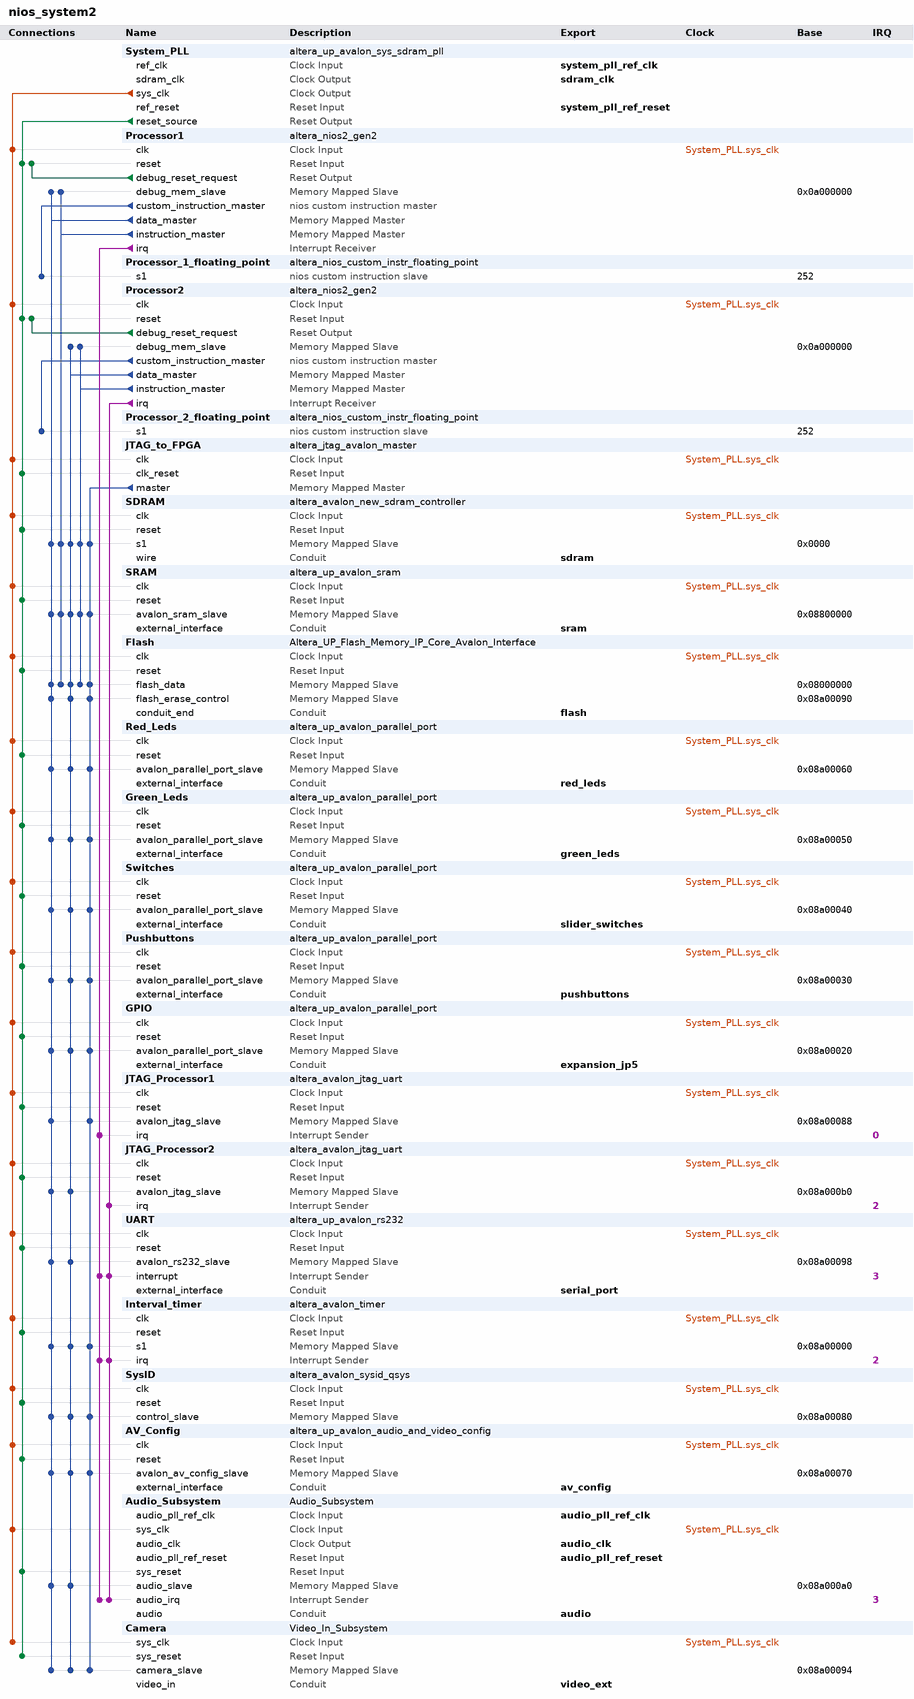
[diagram p0: system contents]
# Platform Designer (Qsys) system nios_system2, Cyclone IV E EP4CE115F29C7
# Parameters at their usual value, and those the tool derives, are not listed.
package require -exact qsys 16.1
create_system nios_system2
set_project_property DEVICE_FAMILY {Cyclone IV E}
set_project_property DEVICE EP4CE115F29C7

add_instance System_PLL altera_up_avalon_sys_sdram_pll 16.1
set_instance_parameter_value System_PLL CV_boards DE1-SoC
set_instance_parameter_value System_PLL gui_outclk 50.0
set_instance_parameter_value System_PLL gui_refclk 50.0

add_instance Processor1 altera_nios2_gen2 16.1
set_instance_parameter_value Processor1 dcache_size 2048
set_instance_parameter_value Processor1 dividerType srt2
set_instance_parameter_value Processor1 exceptionSlave SDRAM.s1
set_instance_parameter_value Processor1 icache_size 4096
set_instance_parameter_value Processor1 impl Tiny
set_instance_parameter_value Processor1 mul_64_impl 1
set_instance_parameter_value Processor1 mul_shift_choice 1
set_instance_parameter_value Processor1 resetSlave SDRAM.s1

add_instance Processor_1_floating_point altera_nios_custom_instr_floating_point 16.1

add_instance Processor2 altera_nios2_gen2 16.1
set_instance_parameter_value Processor2 dcache_size 2048
set_instance_parameter_value Processor2 dividerType srt2
set_instance_parameter_value Processor2 exceptionOffset 67108896
set_instance_parameter_value Processor2 exceptionSlave SDRAM.s1
set_instance_parameter_value Processor2 icache_size 4096
set_instance_parameter_value Processor2 impl Tiny
set_instance_parameter_value Processor2 mul_64_impl 1
set_instance_parameter_value Processor2 mul_shift_choice 1
set_instance_parameter_value Processor2 resetOffset 67108864
set_instance_parameter_value Processor2 resetSlave SDRAM.s1

add_instance Processor_2_floating_point altera_nios_custom_instr_floating_point 16.1

add_instance JTAG_to_FPGA altera_jtag_avalon_master 16.1

add_instance SDRAM altera_avalon_new_sdram_controller 16.1
set_instance_parameter_value SDRAM TAC 5.5
set_instance_parameter_value SDRAM TRCD 20.0
set_instance_parameter_value SDRAM TRP 20.0
set_instance_parameter_value SDRAM casLatency 3
set_instance_parameter_value SDRAM columnWidth 10
set_instance_parameter_value SDRAM dataWidth 32
set_instance_parameter_value SDRAM generateSimulationModel false
set_instance_parameter_value SDRAM model single_Micron_MT48LC4M32B2_7_chip
set_instance_parameter_value SDRAM numberOfBanks 4
set_instance_parameter_value SDRAM numberOfChipSelects 1
set_instance_parameter_value SDRAM powerUpDelay 100.0
set_instance_parameter_value SDRAM refreshPeriod 15.625
set_instance_parameter_value SDRAM rowWidth 13

add_instance SRAM altera_up_avalon_sram 16.1
set_instance_parameter_value SRAM board DE2-115
set_instance_parameter_value SRAM pixel_buffer false

add_instance Flash Altera_UP_Flash_Memory_IP_Core_Avalon_Interface 16.1
set_instance_parameter_value Flash FLASH_MEMORY_ADDRESS_WIDTH 23

add_instance Red_Leds altera_up_avalon_parallel_port 16.1
set_instance_parameter_value Red_Leds board DE2-115
set_instance_parameter_value Red_Leds capture false
set_instance_parameter_value Red_Leds edge Rising
set_instance_parameter_value Red_Leds irq false
set_instance_parameter_value Red_Leds leds Red
set_instance_parameter_value Red_Leds preset LEDs

add_instance Green_Leds altera_up_avalon_parallel_port 16.1
set_instance_parameter_value Green_Leds board DE2-115
set_instance_parameter_value Green_Leds capture false
set_instance_parameter_value Green_Leds edge Rising
set_instance_parameter_value Green_Leds irq false
set_instance_parameter_value Green_Leds preset LEDs

add_instance Switches altera_up_avalon_parallel_port 16.1
set_instance_parameter_value Switches board DE2-115
set_instance_parameter_value Switches capture false
set_instance_parameter_value Switches edge Rising
set_instance_parameter_value Switches irq false
set_instance_parameter_value Switches preset {Slider Switches}

add_instance Pushbuttons altera_up_avalon_parallel_port 16.1
set_instance_parameter_value Pushbuttons board DE2-115
set_instance_parameter_value Pushbuttons capture false
set_instance_parameter_value Pushbuttons edge Rising
set_instance_parameter_value Pushbuttons irq false
set_instance_parameter_value Pushbuttons preset Pushbuttons

add_instance GPIO altera_up_avalon_parallel_port 16.1
set_instance_parameter_value GPIO board DE2-115
set_instance_parameter_value GPIO capture false
set_instance_parameter_value GPIO edge Rising
set_instance_parameter_value GPIO irq false
set_instance_parameter_value GPIO preset {Expansion Header}

add_instance JTAG_Processor1 altera_avalon_jtag_uart 16.1
set_instance_parameter_value JTAG_Processor1 simInteractiveOptions NO_INTERACTIVE_WINDOWS

add_instance JTAG_Processor2 altera_avalon_jtag_uart 16.1
set_instance_parameter_value JTAG_Processor2 simInteractiveOptions NO_INTERACTIVE_WINDOWS

add_instance UART altera_up_avalon_rs232 16.1
set_instance_parameter_value UART baud 115200
set_instance_parameter_value UART parity None

add_instance Interval_timer altera_avalon_timer 16.1
set_instance_parameter_value Interval_timer period 125.0
set_instance_parameter_value Interval_timer periodUnits MSEC

add_instance SysID altera_avalon_sysid_qsys 16.1
set_instance_parameter_value SysID id -1988733927

add_instance AV_Config altera_up_avalon_audio_and_video_config 16.1
set_instance_parameter_value AV_Config audio_in {Microphone to ADC}
set_instance_parameter_value AV_Config bit_length 24
set_instance_parameter_value AV_Config board DE1-SoC
set_instance_parameter_value AV_Config line_in_bypass false
set_instance_parameter_value AV_Config sampling_rate {48 kHz}

add_instance Audio_Subsystem Audio_Subsystem 1.0

add_instance Camera Video_In_Subsystem 1.0

# connections
add_connection System_PLL.sys_clk Audio_Subsystem.sys_clk clock
add_connection System_PLL.sys_clk AV_Config.clk clock
add_connection System_PLL.sys_clk Camera.sys_clk clock
add_connection System_PLL.sys_clk Flash.clk clock
add_connection System_PLL.sys_clk GPIO.clk clock
add_connection System_PLL.sys_clk Green_Leds.clk clock
add_connection System_PLL.sys_clk Interval_timer.clk clock
add_connection System_PLL.sys_clk JTAG_Processor1.clk clock
add_connection System_PLL.sys_clk JTAG_Processor2.clk clock
add_connection System_PLL.sys_clk JTAG_to_FPGA.clk clock
add_connection System_PLL.sys_clk Processor1.clk clock
add_connection System_PLL.sys_clk Processor2.clk clock
add_connection System_PLL.sys_clk Pushbuttons.clk clock
add_connection System_PLL.sys_clk Red_Leds.clk clock
add_connection System_PLL.sys_clk SDRAM.clk clock
add_connection System_PLL.sys_clk SRAM.clk clock
add_connection System_PLL.sys_clk Switches.clk clock
add_connection System_PLL.sys_clk SysID.clk clock
add_connection System_PLL.sys_clk UART.clk clock
add_connection Processor1.debug_reset_request Processor1.reset reset
add_connection Processor2.debug_reset_request Processor2.reset reset
add_connection System_PLL.reset_source Audio_Subsystem.sys_reset reset
add_connection System_PLL.reset_source AV_Config.reset reset
add_connection System_PLL.reset_source Camera.sys_reset reset
add_connection System_PLL.reset_source Flash.reset reset
add_connection System_PLL.reset_source GPIO.reset reset
add_connection System_PLL.reset_source Green_Leds.reset reset
add_connection System_PLL.reset_source Interval_timer.reset reset
add_connection System_PLL.reset_source JTAG_Processor1.reset reset
add_connection System_PLL.reset_source JTAG_Processor2.reset reset
add_connection System_PLL.reset_source JTAG_to_FPGA.clk_reset reset
add_connection System_PLL.reset_source Processor1.reset reset
add_connection System_PLL.reset_source Processor2.reset reset
add_connection System_PLL.reset_source Pushbuttons.reset reset
add_connection System_PLL.reset_source Red_Leds.reset reset
add_connection System_PLL.reset_source SDRAM.reset reset
add_connection System_PLL.reset_source SRAM.reset reset
add_connection System_PLL.reset_source Switches.reset reset
add_connection System_PLL.reset_source SysID.reset reset
add_connection System_PLL.reset_source UART.reset reset
add_connection JTAG_to_FPGA.master AV_Config.avalon_av_config_slave avalon
set_connection_parameter_value JTAG_to_FPGA.master/AV_Config.avalon_av_config_slave baseAddress 0x08a00070
add_connection JTAG_to_FPGA.master Camera.camera_slave avalon
set_connection_parameter_value JTAG_to_FPGA.master/Camera.camera_slave baseAddress 0x08a00094
add_connection JTAG_to_FPGA.master Flash.flash_data avalon
set_connection_parameter_value JTAG_to_FPGA.master/Flash.flash_data baseAddress 0x08000000
add_connection JTAG_to_FPGA.master Flash.flash_erase_control avalon
set_connection_parameter_value JTAG_to_FPGA.master/Flash.flash_erase_control baseAddress 0x08a00090
add_connection JTAG_to_FPGA.master GPIO.avalon_parallel_port_slave avalon
set_connection_parameter_value JTAG_to_FPGA.master/GPIO.avalon_parallel_port_slave baseAddress 0x08a00020
add_connection JTAG_to_FPGA.master Green_Leds.avalon_parallel_port_slave avalon
set_connection_parameter_value JTAG_to_FPGA.master/Green_Leds.avalon_parallel_port_slave baseAddress 0x08a00050
add_connection JTAG_to_FPGA.master Interval_timer.s1 avalon
set_connection_parameter_value JTAG_to_FPGA.master/Interval_timer.s1 baseAddress 0x08a00000
add_connection JTAG_to_FPGA.master JTAG_Processor1.avalon_jtag_slave avalon
set_connection_parameter_value JTAG_to_FPGA.master/JTAG_Processor1.avalon_jtag_slave baseAddress 0x08a00088
add_connection JTAG_to_FPGA.master Pushbuttons.avalon_parallel_port_slave avalon
set_connection_parameter_value JTAG_to_FPGA.master/Pushbuttons.avalon_parallel_port_slave baseAddress 0x08a00030
add_connection JTAG_to_FPGA.master Red_Leds.avalon_parallel_port_slave avalon
set_connection_parameter_value JTAG_to_FPGA.master/Red_Leds.avalon_parallel_port_slave baseAddress 0x08a00060
add_connection JTAG_to_FPGA.master SDRAM.s1 avalon
set_connection_parameter_value JTAG_to_FPGA.master/SDRAM.s1 baseAddress 0x0000
add_connection JTAG_to_FPGA.master SRAM.avalon_sram_slave avalon
set_connection_parameter_value JTAG_to_FPGA.master/SRAM.avalon_sram_slave baseAddress 0x08800000
add_connection JTAG_to_FPGA.master Switches.avalon_parallel_port_slave avalon
set_connection_parameter_value JTAG_to_FPGA.master/Switches.avalon_parallel_port_slave baseAddress 0x08a00040
add_connection JTAG_to_FPGA.master SysID.control_slave avalon
set_connection_parameter_value JTAG_to_FPGA.master/SysID.control_slave baseAddress 0x08a00080
add_connection Processor1.data_master Audio_Subsystem.audio_slave avalon
set_connection_parameter_value Processor1.data_master/Audio_Subsystem.audio_slave baseAddress 0x08a000a0
add_connection Processor1.data_master AV_Config.avalon_av_config_slave avalon
set_connection_parameter_value Processor1.data_master/AV_Config.avalon_av_config_slave baseAddress 0x08a00070
add_connection Processor1.data_master Camera.camera_slave avalon
set_connection_parameter_value Processor1.data_master/Camera.camera_slave baseAddress 0x08a00094
add_connection Processor1.data_master Flash.flash_data avalon
set_connection_parameter_value Processor1.data_master/Flash.flash_data baseAddress 0x08000000
add_connection Processor1.data_master Flash.flash_erase_control avalon
set_connection_parameter_value Processor1.data_master/Flash.flash_erase_control baseAddress 0x08a00090
add_connection Processor1.data_master GPIO.avalon_parallel_port_slave avalon
set_connection_parameter_value Processor1.data_master/GPIO.avalon_parallel_port_slave baseAddress 0x08a00020
add_connection Processor1.data_master Green_Leds.avalon_parallel_port_slave avalon
set_connection_parameter_value Processor1.data_master/Green_Leds.avalon_parallel_port_slave baseAddress 0x08a00050
add_connection Processor1.data_master Interval_timer.s1 avalon
set_connection_parameter_value Processor1.data_master/Interval_timer.s1 baseAddress 0x08a00000
add_connection Processor1.data_master JTAG_Processor1.avalon_jtag_slave avalon
set_connection_parameter_value Processor1.data_master/JTAG_Processor1.avalon_jtag_slave baseAddress 0x08a00088
add_connection Processor1.data_master JTAG_Processor2.avalon_jtag_slave avalon
set_connection_parameter_value Processor1.data_master/JTAG_Processor2.avalon_jtag_slave baseAddress 0x08a000b0
add_connection Processor1.data_master Processor1.debug_mem_slave avalon
set_connection_parameter_value Processor1.data_master/Processor1.debug_mem_slave baseAddress 0x0a000000
add_connection Processor1.data_master Pushbuttons.avalon_parallel_port_slave avalon
set_connection_parameter_value Processor1.data_master/Pushbuttons.avalon_parallel_port_slave baseAddress 0x08a00030
add_connection Processor1.data_master Red_Leds.avalon_parallel_port_slave avalon
set_connection_parameter_value Processor1.data_master/Red_Leds.avalon_parallel_port_slave baseAddress 0x08a00060
add_connection Processor1.data_master SDRAM.s1 avalon
set_connection_parameter_value Processor1.data_master/SDRAM.s1 baseAddress 0x0000
add_connection Processor1.data_master SRAM.avalon_sram_slave avalon
set_connection_parameter_value Processor1.data_master/SRAM.avalon_sram_slave baseAddress 0x08800000
add_connection Processor1.data_master Switches.avalon_parallel_port_slave avalon
set_connection_parameter_value Processor1.data_master/Switches.avalon_parallel_port_slave baseAddress 0x08a00040
add_connection Processor1.data_master SysID.control_slave avalon
set_connection_parameter_value Processor1.data_master/SysID.control_slave baseAddress 0x08a00080
add_connection Processor1.data_master UART.avalon_rs232_slave avalon
set_connection_parameter_value Processor1.data_master/UART.avalon_rs232_slave baseAddress 0x08a00098
add_connection Processor1.instruction_master Flash.flash_data avalon
set_connection_parameter_value Processor1.instruction_master/Flash.flash_data baseAddress 0x08000000
add_connection Processor1.instruction_master Processor1.debug_mem_slave avalon
set_connection_parameter_value Processor1.instruction_master/Processor1.debug_mem_slave baseAddress 0x0a000000
add_connection Processor1.instruction_master SDRAM.s1 avalon
set_connection_parameter_value Processor1.instruction_master/SDRAM.s1 baseAddress 0x0000
add_connection Processor1.instruction_master SRAM.avalon_sram_slave avalon
set_connection_parameter_value Processor1.instruction_master/SRAM.avalon_sram_slave baseAddress 0x08800000
add_connection Processor2.data_master Audio_Subsystem.audio_slave avalon
set_connection_parameter_value Processor2.data_master/Audio_Subsystem.audio_slave baseAddress 0x08a000a0
add_connection Processor2.data_master AV_Config.avalon_av_config_slave avalon
set_connection_parameter_value Processor2.data_master/AV_Config.avalon_av_config_slave baseAddress 0x08a00070
add_connection Processor2.data_master Camera.camera_slave avalon
set_connection_parameter_value Processor2.data_master/Camera.camera_slave baseAddress 0x08a00094
add_connection Processor2.data_master Flash.flash_data avalon
set_connection_parameter_value Processor2.data_master/Flash.flash_data baseAddress 0x08000000
add_connection Processor2.data_master Flash.flash_erase_control avalon
set_connection_parameter_value Processor2.data_master/Flash.flash_erase_control baseAddress 0x08a00090
add_connection Processor2.data_master GPIO.avalon_parallel_port_slave avalon
set_connection_parameter_value Processor2.data_master/GPIO.avalon_parallel_port_slave baseAddress 0x08a00020
add_connection Processor2.data_master Green_Leds.avalon_parallel_port_slave avalon
set_connection_parameter_value Processor2.data_master/Green_Leds.avalon_parallel_port_slave baseAddress 0x08a00050
add_connection Processor2.data_master Interval_timer.s1 avalon
set_connection_parameter_value Processor2.data_master/Interval_timer.s1 baseAddress 0x08a00000
add_connection Processor2.data_master JTAG_Processor2.avalon_jtag_slave avalon
set_connection_parameter_value Processor2.data_master/JTAG_Processor2.avalon_jtag_slave baseAddress 0x08a000b0
add_connection Processor2.data_master Processor2.debug_mem_slave avalon
set_connection_parameter_value Processor2.data_master/Processor2.debug_mem_slave baseAddress 0x0a000000
add_connection Processor2.data_master Pushbuttons.avalon_parallel_port_slave avalon
set_connection_parameter_value Processor2.data_master/Pushbuttons.avalon_parallel_port_slave baseAddress 0x08a00030
add_connection Processor2.data_master Red_Leds.avalon_parallel_port_slave avalon
set_connection_parameter_value Processor2.data_master/Red_Leds.avalon_parallel_port_slave baseAddress 0x08a00060
add_connection Processor2.data_master SDRAM.s1 avalon
set_connection_parameter_value Processor2.data_master/SDRAM.s1 baseAddress 0x0000
add_connection Processor2.data_master SRAM.avalon_sram_slave avalon
set_connection_parameter_value Processor2.data_master/SRAM.avalon_sram_slave baseAddress 0x08800000
add_connection Processor2.data_master Switches.avalon_parallel_port_slave avalon
set_connection_parameter_value Processor2.data_master/Switches.avalon_parallel_port_slave baseAddress 0x08a00040
add_connection Processor2.data_master SysID.control_slave avalon
set_connection_parameter_value Processor2.data_master/SysID.control_slave baseAddress 0x08a00080
add_connection Processor2.data_master UART.avalon_rs232_slave avalon
set_connection_parameter_value Processor2.data_master/UART.avalon_rs232_slave baseAddress 0x08a00098
add_connection Processor2.instruction_master Flash.flash_data avalon
set_connection_parameter_value Processor2.instruction_master/Flash.flash_data baseAddress 0x08000000
add_connection Processor2.instruction_master Processor2.debug_mem_slave avalon
set_connection_parameter_value Processor2.instruction_master/Processor2.debug_mem_slave baseAddress 0x0a000000
add_connection Processor2.instruction_master SDRAM.s1 avalon
set_connection_parameter_value Processor2.instruction_master/SDRAM.s1 baseAddress 0x0000
add_connection Processor2.instruction_master SRAM.avalon_sram_slave avalon
set_connection_parameter_value Processor2.instruction_master/SRAM.avalon_sram_slave baseAddress 0x08800000
add_connection Processor1.irq Audio_Subsystem.audio_irq interrupt
set_connection_parameter_value Processor1.irq/Audio_Subsystem.audio_irq irqNumber 1
add_connection Processor1.irq Interval_timer.irq interrupt
set_connection_parameter_value Processor1.irq/Interval_timer.irq irqNumber 2
add_connection Processor1.irq JTAG_Processor1.irq interrupt
set_connection_parameter_value Processor1.irq/JTAG_Processor1.irq irqNumber 0
add_connection Processor1.irq UART.interrupt interrupt
set_connection_parameter_value Processor1.irq/UART.interrupt irqNumber 3
add_connection Processor2.irq Audio_Subsystem.audio_irq interrupt
set_connection_parameter_value Processor2.irq/Audio_Subsystem.audio_irq irqNumber 3
add_connection Processor2.irq Interval_timer.irq interrupt
set_connection_parameter_value Processor2.irq/Interval_timer.irq irqNumber 1
add_connection Processor2.irq JTAG_Processor2.irq interrupt
set_connection_parameter_value Processor2.irq/JTAG_Processor2.irq irqNumber 2
add_connection Processor2.irq UART.interrupt interrupt
set_connection_parameter_value Processor2.irq/UART.interrupt irqNumber 0
add_connection Processor1.custom_instruction_master Processor_1_floating_point.s1 nios_custom_instruction
set_connection_parameter_value Processor1.custom_instruction_master/Processor_1_floating_point.s1 CIName nios_custom_instr_floating_point_0
set_connection_parameter_value Processor1.custom_instruction_master/Processor_1_floating_point.s1 baseAddress 252
add_connection Processor2.custom_instruction_master Processor_2_floating_point.s1 nios_custom_instruction
set_connection_parameter_value Processor2.custom_instruction_master/Processor_2_floating_point.s1 CIName processor_2_floating_point
set_connection_parameter_value Processor2.custom_instruction_master/Processor_2_floating_point.s1 baseAddress 252

# exported interfaces
add_interface audio conduit end
set_interface_property audio EXPORT_OF Audio_Subsystem.audio
add_interface audio_clk clock source
set_interface_property audio_clk EXPORT_OF Audio_Subsystem.audio_clk
add_interface audio_pll_ref_clk clock sink
set_interface_property audio_pll_ref_clk EXPORT_OF Audio_Subsystem.audio_pll_ref_clk
add_interface audio_pll_ref_reset reset sink
set_interface_property audio_pll_ref_reset EXPORT_OF Audio_Subsystem.audio_pll_ref_reset
add_interface av_config conduit end
set_interface_property av_config EXPORT_OF AV_Config.external_interface
add_interface expansion_jp5 conduit end
set_interface_property expansion_jp5 EXPORT_OF GPIO.external_interface
add_interface flash conduit end
set_interface_property flash EXPORT_OF Flash.conduit_end
add_interface green_leds conduit end
set_interface_property green_leds EXPORT_OF Green_Leds.external_interface
add_interface pushbuttons conduit end
set_interface_property pushbuttons EXPORT_OF Pushbuttons.external_interface
add_interface red_leds conduit end
set_interface_property red_leds EXPORT_OF Red_Leds.external_interface
add_interface sdram conduit end
set_interface_property sdram EXPORT_OF SDRAM.wire
add_interface sdram_clk clock source
set_interface_property sdram_clk EXPORT_OF System_PLL.sdram_clk
add_interface serial_port conduit end
set_interface_property serial_port EXPORT_OF UART.external_interface
add_interface slider_switches conduit end
set_interface_property slider_switches EXPORT_OF Switches.external_interface
add_interface sram conduit end
set_interface_property sram EXPORT_OF SRAM.external_interface
add_interface system_pll_ref_clk clock sink
set_interface_property system_pll_ref_clk EXPORT_OF System_PLL.ref_clk
add_interface system_pll_ref_reset reset sink
set_interface_property system_pll_ref_reset EXPORT_OF System_PLL.ref_reset
add_interface video_ext conduit end
set_interface_property video_ext EXPORT_OF Camera.video_in

set_interconnect_requirement {$system} qsys_mm.clockCrossingAdapter HANDSHAKE
set_interconnect_requirement {$system} qsys_mm.enableEccProtection FALSE
set_interconnect_requirement {$system} qsys_mm.insertDefaultSlave FALSE
set_interconnect_requirement {$system} qsys_mm.maxAdditionalLatency 1

save_system nios_system2.qsys
